# EAGLE design M707C+ (EAGLE 6.6.0)
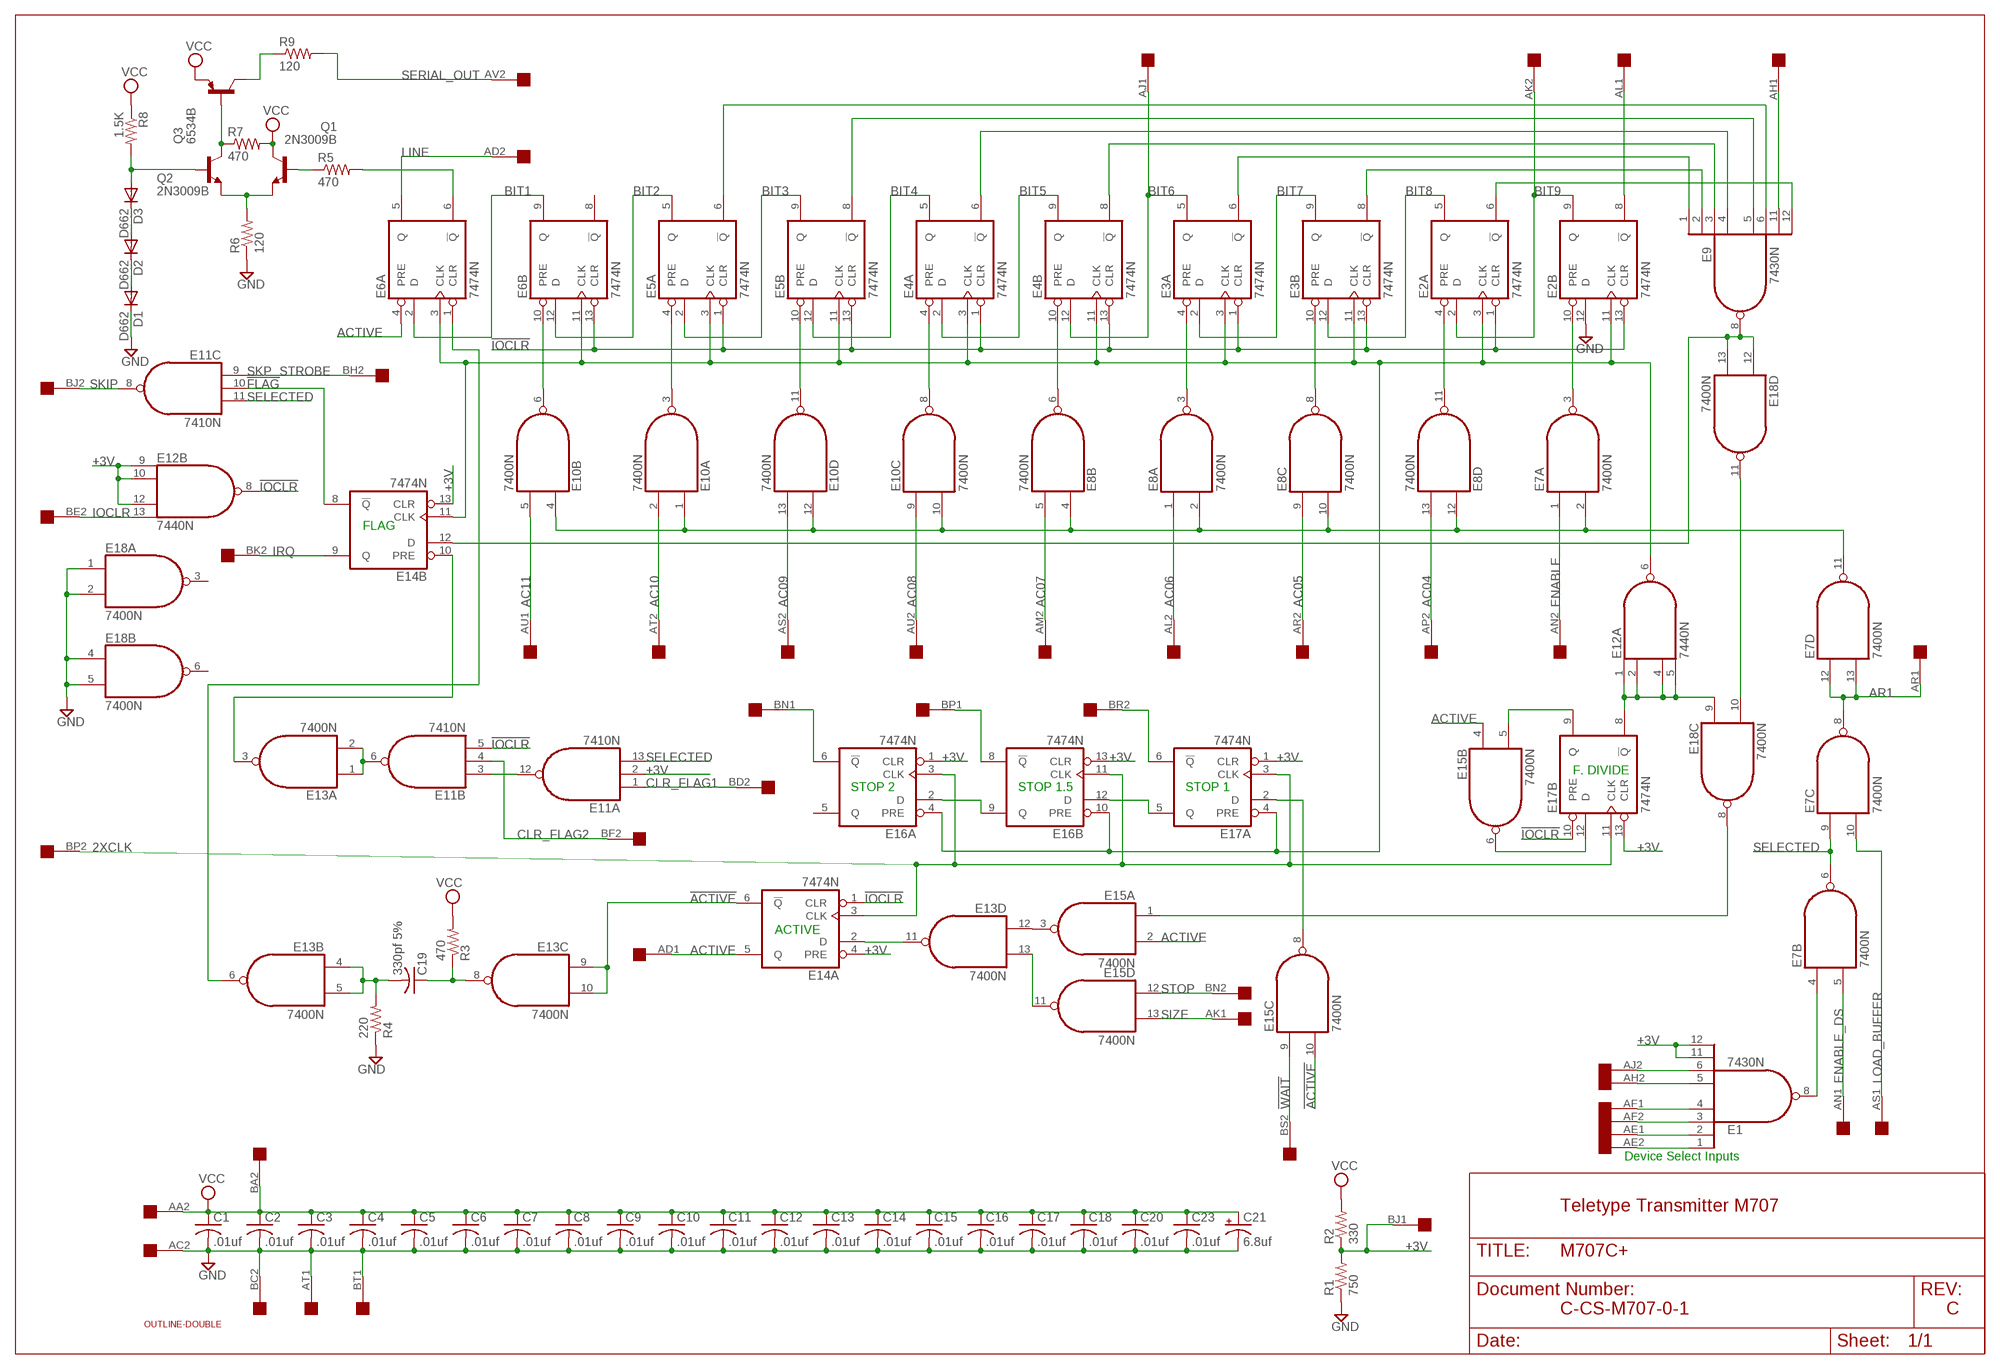
[diagram p0: schematic, sheet 1]

## Parts
C1  .01uf  C-US075-032X103  [C075-032X103]
C2  .01uf  C-US075-032X103  [C075-032X103]
C3  .01uf  C-US075-032X103  [C075-032X103]
C4  .01uf  C-US075-032X103  [C075-032X103]
C5  .01uf  C-US075-032X103  [C075-032X103]
C6  .01uf  C-US075-032X103  [C075-032X103]
C7  .01uf  C-US075-032X103  [C075-032X103]
C8  .01uf  C-US075-032X103  [C075-032X103]
C9  .01uf  C-US075-032X103  [C075-032X103]
C10  .01uf  C-US075-032X103  [C075-032X103]
C11  .01uf  C-US075-032X103  [C075-032X103]
C12  .01uf  C-US075-032X103  [C075-032X103]
C13  .01uf  C-US075-032X103  [C075-032X103]
C14  .01uf  C-US075-032X103  [C075-032X103]
C15  .01uf  C-US075-032X103  [C075-032X103]
C16  .01uf  C-US075-032X103  [C075-032X103]
C17  .01uf  C-US075-032X103  [C075-032X103]
C18  .01uf  C-US075-032X103  [C075-032X103]
C19  330pf 5%  C-US150-054X183  [C150-054X183]
C20  .01uf  C-US075-032X103  [C075-032X103]
C21  6.8uf  CPOL-USE15-5AXIAL  [E15-5]
C23  .01uf  C-US075-032X103  [C075-032X103]
D1  D662  BY609  [SOD61B]
D2  D662  BY609  [SOD61B]
D3  D662  BY609  [SOD61B]
E1  7430N  [DIL14]
E2  7474N  74S74N  [DIL14]
E3  7474N  74S74N  [DIL14]
E4  7474N  74S74N  [DIL14]
E5  7474N  74S74N  [DIL14]
E6  7474N  74S74N  [DIL14]
E7  7400N  [DIL14]
E8  7400N  [DIL14]
E9  7430N  [DIL14]
E10  7400N  [DIL14]
E11  7410N  [DIL14]
E12  7440N  74S20N  [DIL14]
E13  7400N  [DIL14]
E14  7474N  74S74N  [DIL14]
E15  7400N  [DIL14]
E16  7474N  74S74N  [DIL14]
E17  7474N  74S74N  [DIL14]
E18  7400N  [DIL14]
Q1  2N3009B  2N4124-NPN-TO92-CBE  [TO92-CBE]
Q2  2N3009B  2N4124-NPN-TO92-CBE  [TO92-CBE]
Q3  6534B  2N4126-PNP-TO92-CBE  [TO92-CBE]
R1  750  R-US_0207/15  [0207/15]
R2  330  R-US_0207/15  [0207/15]
R3  470  R-US_0207/10  [0207/10]
R4  220  R-US_0207/10  [0207/10]
R5  470  R-US_0207/10  [0207/10]
R6  120  R-US_0207/15  [0207/15]
R7  470  R-US_0207/10  [0207/10]
R8  1.5K  R-US_0207/15  [0207/15]
R9  120  R-US_0204/7  [0204/7]
U$1  OUTLINE-DOUBLE  [DOUBLE]
U$2  DOUBLE  [EDGE-CON4]

## Nets
2XCLK: E14.3(A:CLK) E16.3(A:CLK) E16.11(B:CLK) E17.3(A:CLK) E17.11(B:CLK) U$2.BP2
!ACTIVE: E13.9(C:I0) E13.10(C:I1) E14.6(A:!Q) E15.10(C:I1)
!FLAG: E11.10(C:I1) E14.8(B:!Q)
!IOCLR: E2.1(A:CLR) E2.13(B:CLR) E3.1(A:CLR) E3.13(B:CLR) E4.1(A:CLR) E4.13(B:CLR) E5.1(A:CLR) E5.13(B:CLR) E6.13(B:CLR) E11.5(B:I2) E12.8(B:O) E14.1(A:CLR) E17.10(B:PRE)
!WAIT: E15.9(C:I0) U$2.BS2
+3V: E1.11(I6) E1.12(I7) E11.2(A:I1) E12.9(B:I0) E12.10(B:I1) E12.12(B:I2) E14.4(A:PRE) E14.13(B:CLR) E16.1(A:CLR) E16.13(B:CLR) E17.1(A:CLR) E17.13(B:CLR) R1.2 R2.1 U$2.BJ1
AC04: E8.13(D:I1) U$2.AP2
AC05: E8.9(C:I0) U$2.AR2
AC06: E8.1(A:I0) U$2.AL2
AC07: E8.5(B:I1) U$2.AM2
AC08: E10.9(C:I0) U$2.AU2
AC09: E10.13(D:I1) U$2.AS2
AC10: E10.2(A:I1) U$2.AT2
AC11: E10.5(B:I1) U$2.AU1
ACTIVE: E6.4(A:PRE) E14.5(A:Q) E15.2(A:I1) E15.4(B:I0) U$2.AD1
AE1: E1.2(I1) U$2.AE1
AF1: E1.4(I3) U$2.AF1
AH1: E9.11(I6) U$2.AH1
AL1: E2.8(B:!Q) U$2.AL1
AR1: E7.8(C:O) E7.12(D:I0) E7.13(D:I1) U$2.AR1
BIT1: E6.2(A:D) E6.9(B:Q)
BIT2: E5.5(A:Q) E6.12(B:D)
BIT3: E5.2(A:D) E5.9(B:Q)
BIT4: E4.5(A:Q) E5.12(B:D)
BIT5: E4.2(A:D) E4.9(B:Q)
BIT6: E3.5(A:Q) E4.12(B:D) U$2.AJ1
BIT7: E3.2(A:D) E3.9(B:Q)
BIT8: E2.5(A:Q) E3.12(B:D)
BIT9: E2.2(A:D) E2.9(B:Q) U$2.AK2
BN1: E16.6(A:!Q) U$2.BN1
BP1: E16.8(B:!Q) U$2.BP1
CLR_FLAG1: E11.1(A:I0) U$2.BD2
CLR_FLAG2: E11.4(B:I1) U$2.BF2
ENABLE: E7.1(A:I0) U$2.AN2
ENABLE_DS: E7.5(B:I1) U$2.AN1
GND [Supply]: C1.2 C2.2 C3.2 C4.2 C5.2 C6.2 C7.2 C8.2 C9.2 C10.2 C11.2 C12.2 C13.2 C14.2 C15.2 C16.2 C17.2 C18.2 C20.2 C21.- C23.2 D1.C E2.12(B:D) E18.1(A:I0) E18.2(A:I1) E18.4(B:I0) E18.5(B:I1) R1.1 R4.1 R6.1 U$2.AC2 U$2.AT1 U$2.BC2 U$2.BT1
IOCLR: E12.13(B:I3) U$2.BE2
IRQ: E14.9(B:Q) U$2.BK2
LINE: E6.5(A:Q) U$2.AD2
LOAD_BUFFER: E7.10(C:I1) U$2.AS1
N$1: C19.1 E13.8(C:O) R3.1
N$2: C19.2 E13.4(B:I0) E13.5(B:I1) R4.2
N$3: E2.4(A:PRE) E8.11(D:O)
N$4: E6.1(A:CLR) E13.6(B:O)
N$5: E2.3(A:CLK) E2.11(B:CLK) E3.3(A:CLK) E3.11(B:CLK) E4.3(A:CLK) E4.11(B:CLK) E5.3(A:CLK) E5.11(B:CLK) E6.3(A:CLK) E6.11(B:CLK) E12.6(A:O) E14.11(B:CLK) E16.4(A:PRE) E16.10(B:PRE) E17.4(A:PRE)
N$6: E9.8(O) E14.12(B:D) E18.12(D:I0) E18.13(D:I1)
N$7: E2.6(A:!Q) E9.12(I7)
N$8: Q3.C R9.1
N$9: E1.8(O) E7.4(B:I0)
N$12: E1.6(I5) U$2.AJ2
N$13: E1.5(I4) U$2.AH2
N$15: E1.3(I2) U$2.AF2
N$17: E1.1(I0) U$2.AE2
N$19: E7.2(A:I1) E7.11(D:O) E8.2(A:I1) E8.4(B:I0) E8.10(C:I1) E8.12(D:I0) E10.1(A:I0) E10.4(B:I0) E10.10(C:I1) E10.12(D:I0)
N$20: E2.10(B:PRE) E7.3(A:O)
N$22: D1.A D2.C
N$23: D2.A D3.C
N$24: Q1.B R5.1
N$26: Q2.C Q3.B R7.1
N$27: Q1.E Q2.E R6.2
N$30: D3.A Q2.B R8.2
N$40: E6.6(A:!Q) R5.2
N$62: E13.13(D:I1) E15.11(D:O)
N$63: E17.6(A:!Q) U$2.BR2
N$65: E3.4(A:PRE) E8.3(A:O)
N$129: E15.1(A:I0) E18.8(C:O)
N$131: E13.12(D:I0) E15.3(A:O)
N$132: E11.3(B:I0) E11.12(A:O)
N$133: E12.1(A:I0) E12.2(A:I1) E12.4(A:I2) E12.5(A:I3) E17.8(B:!Q) E18.9(C:I0)
N$138: E16.2(A:D) E16.9(B:Q)
N$142: E3.6(A:!Q) E9.1(I0)
N$147: E4.4(A:PRE) E10.8(C:O)
N$152: E3.8(B:!Q) E9.2(I1)
N$153: E4.8(B:!Q) E9.3(I2)
N$154: E4.6(A:!Q) E9.4(I3)
N$155: E5.8(B:!Q) E9.5(I4)
N$156: E5.6(A:!Q) E9.6(I5)
N$161: E15.8(C:O) E17.2(A:D)
N$163: E11.6(B:O) E13.1(A:I0) E13.2(A:I1)
N$166: E16.12(B:D) E17.5(A:Q)
N$167: E13.3(A:O) E14.10(B:PRE)
N$171: E5.4(A:PRE) E10.3(A:O)
N$178: E13.11(D:O) E14.2(A:D)
N$358: E15.6(B:O) E17.12(B:D)
N$362: E15.5(B:I1) E17.9(B:Q)
N$378: E3.10(B:PRE) E8.8(C:O)
N$381: E4.10(B:PRE) E8.6(B:O)
N$387: E5.10(B:PRE) E10.11(D:O)
N$393: E6.10(B:PRE) E10.6(B:O)
N$460: E18.10(C:I1) E18.11(D:O)
SELECTED: E7.6(B:O) E7.9(C:I0) E11.11(C:I2) E11.13(A:I2)
SERIAL_OUT: R9.2 U$2.AV2
SIZE: E15.13(D:I1) U$2.AK1
SKIP: E11.8(C:O) U$2.BJ2
SKP_STROBE: E11.9(C:I0) U$2.BH2
STOP: E15.12(D:I0) U$2.BN2
VCC [Supply]: C1.1 C2.1 C3.1 C4.1 C5.1 C6.1 C7.1 C8.1 C9.1 C10.1 C11.1 C12.1 C13.1 C14.1 C15.1 C16.1 C17.1 C18.1 C20.1 C21.+ C23.1 Q1.C Q3.E R2.2 R3.2 R7.2 R8.1 U$2.AA2 U$2.BA2
Unconnected: E6.8(B:!Q) E16.5(A:Q) E18.3(A:O) E18.6(B:O) U$2.AA1 U$2.AB1 U$2.AB2 U$2.AC1 U$2.AM1 U$2.AP1 U$2.AV1 U$2.BA1 U$2.BB1 U$2.BB2 U$2.BC1 U$2.BD1 U$2.BE1 U$2.BF1 U$2.BH1 U$2.BK1 U$2.BL1 U$2.BL2 U$2.BM1 U$2.BM2 U$2.BR1 U$2.BS1 U$2.BT2 U$2.BU1 U$2.BU2 U$2.BV1 U$2.BV2

## Notes on the sheet
- FLAG
- F. DIVIDE
- STOP 2 | STOP 1.5 | STOP 1
- ACTIVE
- Device Select Inputs
- Teletype Transmitter M707
- C-CS-M707-0-1 | C

## Power pins joined to a net without a drawn wire
GND: E1.7(GND) E2.7(P:GND) E3.7(P:GND) E4.7(P:GND) E5.7(P:GND) E6.7(P:GND) E7.7(P:GND) E8.7(P:GND) E9.7(GND) E10.7(P:GND) E11.7(P:GND) E12.7(P:GND) E13.7(P:GND) E14.7(P:GND) E15.7(P:GND) E16.7(P:GND) E17.7(P:GND) E18.7(P:GND)
VCC: E1.14(VCC) E2.14(P:VCC) E3.14(P:VCC) E4.14(P:VCC) E5.14(P:VCC) E6.14(P:VCC) E7.14(P:VCC) E8.14(P:VCC) E9.14(VCC) E10.14(P:VCC) E11.14(P:VCC) E12.14(P:VCC) E13.14(P:VCC) E14.14(P:VCC) E15.14(P:VCC) E16.14(P:VCC) E17.14(P:VCC) E18.14(P:VCC)

## Library data of the parts
C1-C20 C23 = rcl:C-US: CAPACITOR, American symbol
C21 = rcl:CPOL-US: POLARIZED CAPACITOR, American symbol
D1-D3 = diode:BY609: DIODE
E1 E9 = 74xx-us:74*30: 8-input NAND gate
E2-E6 E14 E16 E17 = 74xx-us:74*74: Dual D type positive edge triggered FLIP FLOP, preset and clear
E7 E8 E10 E13 E15 E18 = 74xx-us:74*00: Quad 2-input NAND gate
E11 = 74xx-us:74*10: Triple 3-input NAND gate
E12 = 74xx-us:74*20: Dual 4-input NAND gate
Q1 Q2 = transistor:*-NPN-: NPN Transistror BF959 corrected 2008.03.06
Q3 = transistor:*-PNP-: PNP Transistror
R1-R9 = rcl:R-US_: RESISTOR, American symbol
U$1 = dec-con:OUTLINE-*: Board outlines for DEC boards.
U$2 = dec-con:DOUBLE: Double-Height DEC board

## Net classes
1 Supply: width 0.813 mm

## Board
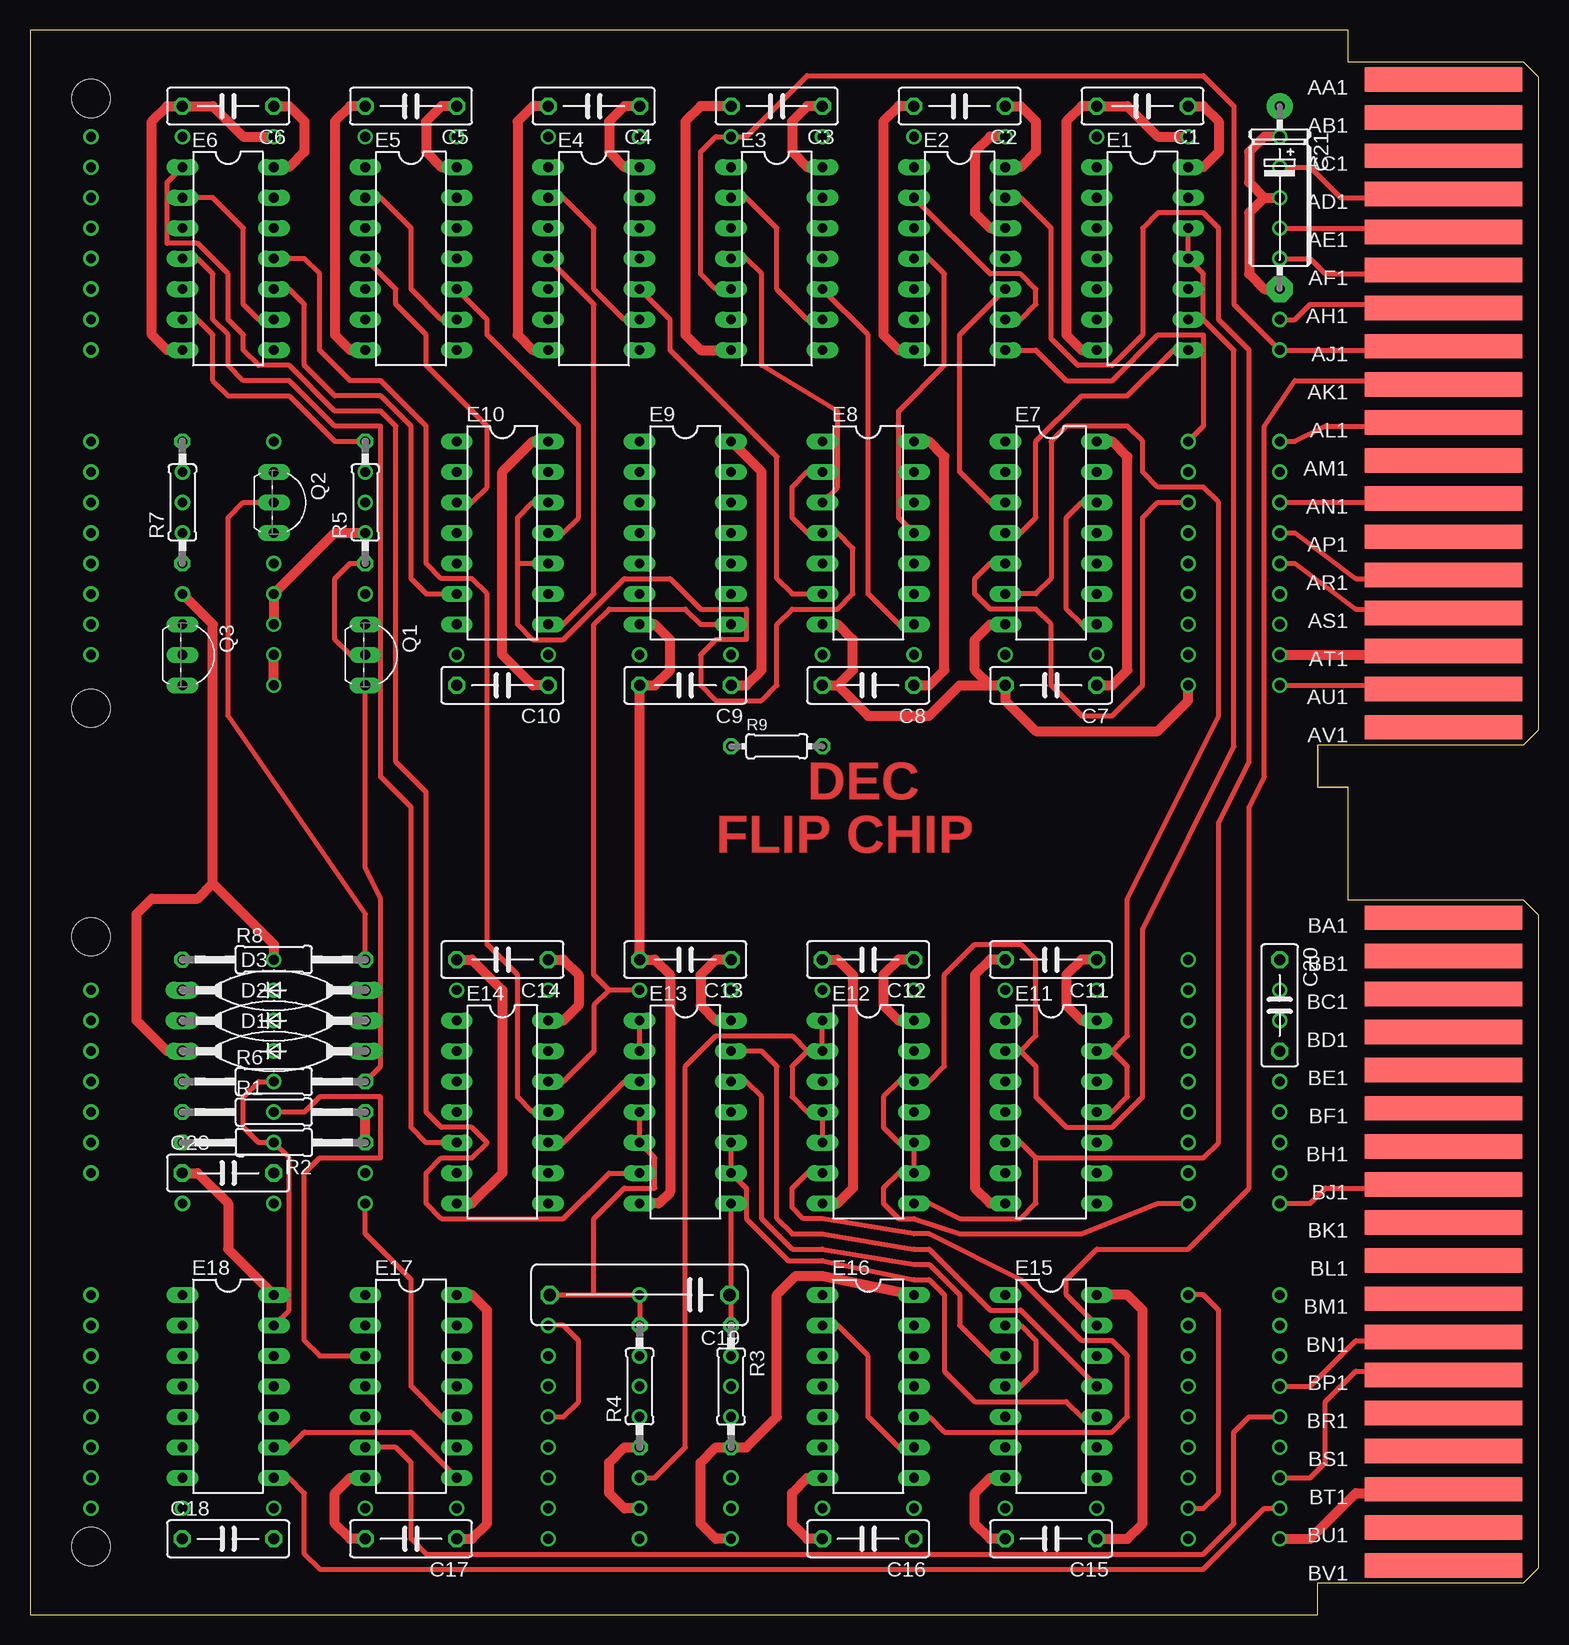
[diagram p1: board, top side]
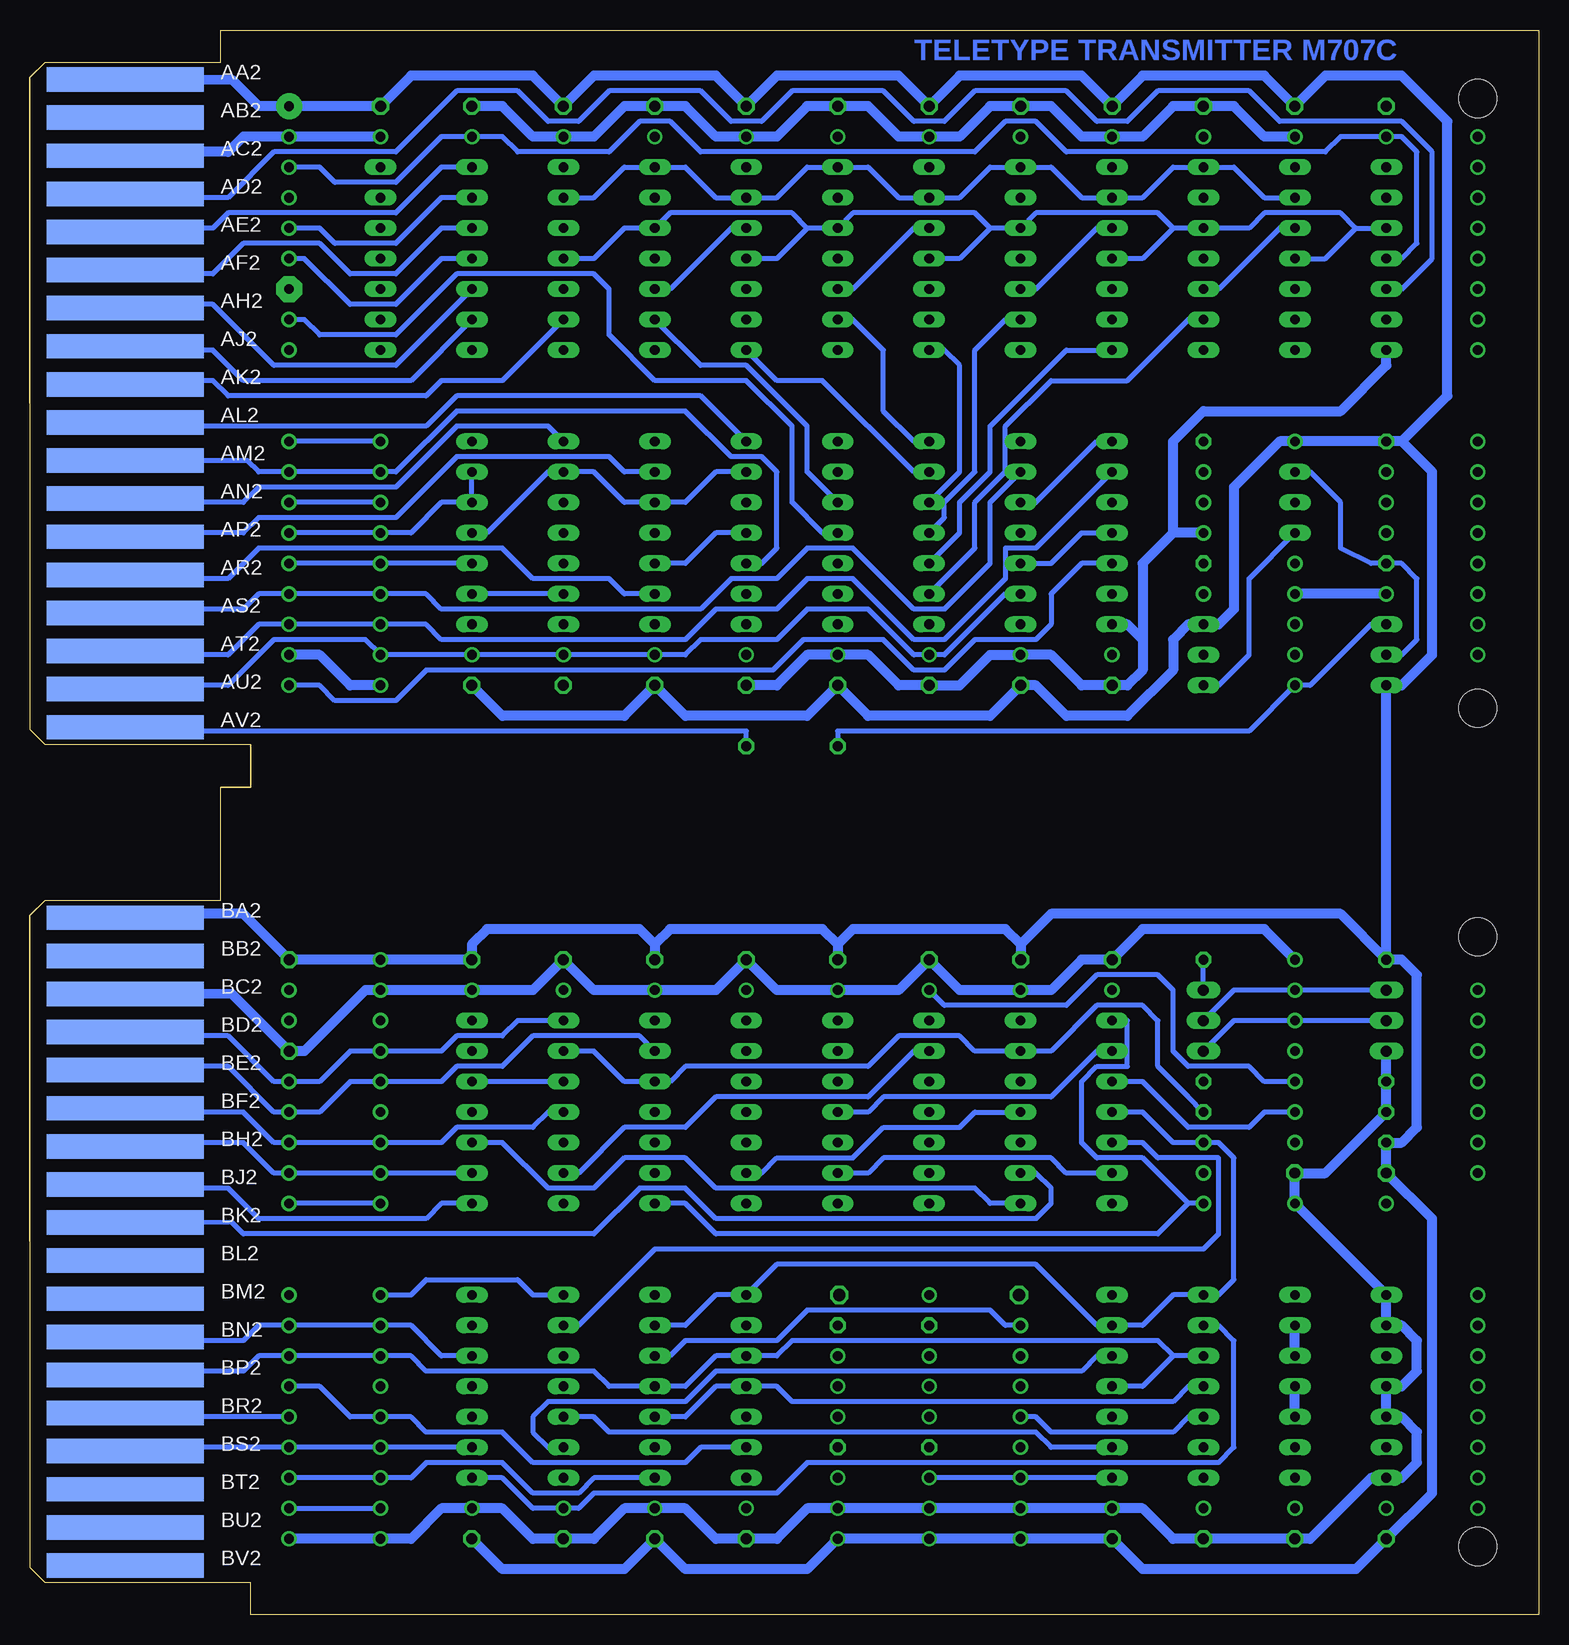
[diagram p2: board, bottom side, seen from below]

Size 125.73 x 132.08 mm. Coordinates in mm from the lower left corner, seen from the top.
Copper layers (1+16): Top 0.035mm / dielectric 1.5mm / Bottom 0.035mm
Design rules "16mils": minimum track width 16mil, minimum drill 32mil, track to track 15mil, track to pad 10mil, pad to pad 10mil, via to via 10mil, smd to smd 10mil, copper to edge 13mil, drill to drill 10mil, minimum pad ring 10mil, minimum via ring 8mil, stop-mask expansion 0mil, vias tented up to drill 0mil, thermal gap 10mil

### Footprints (pad centres in the part's own frame; a part is rotated, then mirrored left to right if it is on the bottom)
C075-032X103 = drill 0.914 octagon: 1 -3.81,0; 2 3.81,0
C150-054X183 = drill 1.016 octagon: 1 -7.493,0; 2 7.493,0
E15-5 = drill 0.813 pad 2.159: + -7.62,0 | drill 0.813 pad 2.159 octagon: - 7.62,0
SOD61B = drill 0.914 long: A 7.62,0; C -7.62,0
DIL14 = drill 0.813 long: 1 -7.62,-3.81; 2 -5.08,-3.81; 3 -2.54,-3.81; 4 0,-3.81; 5 2.54,-3.81; 6 5.08,-3.81; 7 7.62,-3.81; 8 7.62,3.81; 9 5.08,3.81; 10 2.54,3.81; 11 0,3.81; 12 -2.54,3.81; 13 -5.08,3.81; 14 -7.62,3.81
TO92-CBE = drill 0.813 long: B 0,0; C -2.54,0; E 2.54,0
0207/15 = drill 0.813 octagon: 1 -7.62,0; 2 7.62,0
0207/10 = drill 0.813 octagon: 1 -5.08,0; 2 5.08,0
0204/7 = drill 0.813 octagon: 1 -3.81,0; 2 3.81,0
DOUBLE = hole 3.175: 120.65,56.515; 120.65,5.715; 120.65,75.565; 120.65,126.365
EDGE-CON4 = smd 13.106 x 2.032: AA1 7.938,4.128; AB1 7.938,7.303; AC1 7.938,10.477; AD1 7.938,13.652; AE1 7.938,16.828; AF1 7.938,20.003; AH1 7.938,23.177; AJ1 7.938,26.352; AK1 7.938,29.527; AL1 7.938,32.703; AM1 7.938,35.877; AN1 7.938,39.053; AP1 7.938,42.227; AR1 7.938,45.403; AS1 7.938,48.578; AT1 7.938,51.752; AU1 7.938,54.928; AV1 7.938,58.102; BA1 7.938,73.978; BB1 7.938,77.153; BC1 7.938,80.328; BD1 7.938,83.502; BE1 7.938,86.677; BF1 7.938,89.853; BH1 7.938,93.028; BJ1 7.938,96.203; BK1 7.938,99.377; BL1 7.938,102.552; BM1 7.938,105.728; BN1 7.938,108.903; BP1 7.938,112.078; BR1 7.938,115.252; BS1 7.938,118.427; BT1 7.938,121.603; BU1 7.938,124.778; BV1 7.938,127.953 | smd 13.106 x 2.032 bottom: AA2 7.938,4.128; AB2 7.938,7.303; AC2 7.938,10.477; AD2 7.938,13.652; AE2 7.938,16.828; AF2 7.938,20.003; AH2 7.938,23.177; AJ2 7.938,26.352; AK2 7.938,29.527; AL2 7.938,32.703; AM2 7.938,35.877; AN2 7.938,39.053; AP2 7.938,42.227; AR2 7.938,45.403; AS2 7.938,48.578; AT2 7.938,51.752; AU2 7.938,54.928; AV2 7.938,58.102; BA2 7.938,73.978; BB2 7.938,77.153; BC2 7.938,80.328; BD2 7.938,83.502; BE2 7.938,86.677; BF2 7.938,89.853; BH2 7.938,93.028; BJ2 7.938,96.203; BK2 7.938,99.377; BL2 7.938,102.552; BM2 7.938,105.728; BN2 7.938,108.903; BP2 7.938,112.078; BR2 7.938,115.252; BS2 7.938,118.427; BT2 7.938,121.603; BU2 7.938,124.778; BV2 7.938,127.953

### Placement (x,y rotation side)
C1  92.71,125.73 180 top
C2  77.47,125.73 180 top
C3  62.23,125.73 180 top
C4  46.99,125.73 180 top
C5  31.75,125.73 180 top
C6  16.51,125.73 180 top
C7  85.09,77.47 180 top
C8  69.85,77.47 180 top
C9  54.61,77.47 180 top
C10  39.37,77.47 180 top
C11  85.09,54.61 180 top
C12  69.85,54.61 180 top
C13  54.61,54.61 180 top
C14  39.37,54.61 180 top
C15  85.09,6.35 180 top
C16  69.85,6.35 180 top
C17  31.75,6.35 180 top
C18  16.51,6.35 0 top
C19  50.8,26.67 180 top
C20  104.14,50.8 270 top
C21  104.14,118.11 270 top
C23  16.51,36.83 0 top
D1  20.32,46.99 0 top
D2  20.32,49.53 0 top
D3  20.32,52.07 0 top
E1  92.71,113.03 270 top
E2  77.47,113.03 270 top
E3  62.23,113.03 270 top
E4  46.99,113.03 270 top
E5  31.75,113.03 270 top
E6  16.51,113.03 270 top
E7  85.09,90.17 270 top
E8  69.85,90.17 270 top
E9  54.61,90.17 270 top
E10  39.37,90.17 270 top
E11  85.09,41.91 270 top
E12  69.85,41.91 270 top
E13  54.61,41.91 270 top
E14  39.37,41.91 270 top
E15  85.09,19.05 270 top
E16  69.85,19.05 270 top
E17  31.75,19.05 270 top
E18  16.51,19.05 270 top
Q1  27.94,80.01 270 top
Q2  20.32,92.71 270 top
Q3  12.7,80.01 270 top
R1  20.32,41.91 0 top
R2  20.32,39.37 180 top
R3  58.42,19.05 270 top
R4  50.8,19.05 90 top
R5  27.94,92.71 90 top
R6  20.32,44.45 0 top
R7  12.7,92.71 90 top
R8  20.32,54.61 0 top
R9  62.23,72.39 0 top
U$1  125.73,132.08 180 top
U$2  125.73,132.08 180 top

### Tracks (layer width: path | path; a pad name or v marks a point on that pad's centre or on a via)
2XCLK  (via drill 0.81 pad 1.27)
  Top 0.406: E17.3 24.13,21.59 22.86,22.86 22.86,36.83 24.13,38.1 29.21,38.1 29.21,43.18 24.13,43.18 22.86,41.91 v20.32,41.91
  Bottom 0.406: E17.3 30.48,21.59 | 30.48,21.59 33.02,19.05 E17.11 | 30.48,21.59 31.75,22.86 62.23,22.86 63.5,21.59 E16.3 68.58,21.59 71.12,19.05 E16.11 77.47,19.05 78.74,20.32 92.71,20.32 93.98,21.59 v96.52,21.59 v104.14,21.59 106.68,21.59 107.95,20.32 111.76,20.32 112.09,19.99 U$2.BP2 | v20.32,41.91 22.86,41.91 24.13,40.64 29.21,40.64 33.02,44.45 E14.3
!ACTIVE
  Top 0.406: E15.10 87.63,16.51 86.36,17.78 78.74,17.78 76.2,20.32 76.2,26.67 74.93,27.94 73.66,27.94 66.04,29.53 63.18,29.53 59.69,33.02 59.69,35.56 E13.9 E13.10
  Bottom 0.406: E14.6 39.37,36.83 40.64,38.1 54.61,38.1 55.88,36.83 E13.9
!FLAG
  Bottom 0.406: E11.10 86.36,39.37 82.55,35.56 78.74,35.56 76.2,38.1 71.12,38.1 68.58,35.56 46.99,35.56 45.72,34.29 E14.8
!IOCLR  (via drill 0.81 pad 1.27)
  Top 0.406: E2.13 82.55,118.11 85.09,115.57 85.09,106.36 87.31,104.14 90.17,104.14 92.71,106.68 92.71,115.57 93.98,116.84 97.79,116.84 99.06,115.57 99.06,107.95 101.6,105.41 101.6,71.12 99.06,66.04 99.06,39.37 97.79,38.1 83.82,38.1 | E12.8 74.93,34.29 77.47,33.02 82.55,33.02 83.82,34.29 83.82,38.1 | 83.82,38.1 82.55,39.37 E11.5 | v27.94,34.29 27.94,31.75 31.75,27.94 31.75,19.05 34.29,16.51 E17.10
  Bottom 0.406: E6.13 22.86,118.11 25.4,120.65 E5.1 30.48,120.65 33.02,118.11 E5.13 38.1,118.11 40.64,120.65 E4.1 45.72,120.65 48.26,118.11 E4.13 53.34,118.11 55.88,120.65 E3.1 60.96,120.65 63.5,118.11 E3.13 68.58,118.11 71.12,120.65 E2.1 76.2,120.65 78.74,118.11 E2.13 | v27.94,34.29 29.21,34.29 | 29.21,34.29 33.02,38.1 36.83,38.1 38.1,39.37 38.1,44.45 36.83,45.72 34.29,45.72 34.29,49.53 E14.1 | 29.21,34.29 31.75,31.75 68.58,31.75 71.12,34.29 E12.8
!WAIT  (via drill 0.81 pad 1.27)
  Bottom 0.406: E15.9 v96.52,13.97 v104.14,13.97 111.76,13.97 112.06,13.66 U$2.BS2
+3V  (via drill 0.81 pad 1.27)
  Top 0.406: v104.14,34.29 106.68,34.29 107.95,35.56 114.3,35.56 114.63,35.89 U$2.BJ1 | E1.12 E1.11 97.79,111.76 97.79,107.95 100.33,105.41 100.33,72.39 92.71,57.15 92.71,43.18 90.17,40.64 86.36,40.64 83.82,43.18 83.82,45.72 82.55,46.99 | v96.52,34.29 93.98,34.29 87.63,31.75 77.47,31.75 73.66,33.02 72.39,33.02 71.12,34.29 71.12,35.56 72.39,36.83 E12.9 E12.10 72.39,39.37 71.12,40.64 71.12,43.18 72.39,44.45 E12.12 74.93,44.45 76.2,45.72 76.2,53.34 78.74,55.88 82.55,55.88 83.82,54.61 83.82,48.26 82.55,46.99 | E11.2 82.55,46.99
  Top 0.813: R2.1 R1.2
  Bottom 0.406: v96.52,34.29 v104.14,34.29 | E16.13 71.12,24.13 68.58,26.67 E16.1 63.5,29.21 41.91,29.21 36.83,24.13 E17.13 33.02,24.13 30.48,26.67 E17.1 26.67,26.67 25.4,27.94 25.4,38.1 26.67,39.37 R2.1 30.48,39.37 33.02,41.91 E14.4 | E11.2 78.74,46.99 76.2,44.45 E12.12 72.39,44.45 71.12,45.72 55.88,45.72 53.34,48.26 48.26,48.26 46.99,46.99 E14.13 40.64,46.99 36.83,50.8 33.02,50.8 31.75,49.53 31.75,45.72 29.21,43.18 R1.2
AC04
  Bottom 0.406: U$2.AP2 112.09,89.84 111.76,90.17 107.95,90.17 106.68,91.44 95.25,91.44 90.17,96.52 77.47,96.52 76.2,95.25 E8.13
AC05
  Bottom 0.406: E8.9 76.2,85.09 77.47,86.36 83.82,86.36 86.36,88.9 106.68,88.9 109.22,86.36 111.76,86.36 112.09,86.69 U$2.AR2
AC06
  Bottom 0.406: U$2.AL2 112.09,99.39 111.76,99.06 92.71,99.06 90.17,101.6 69.85,101.6 E8.1
AC07  (via drill 0.81 pad 1.27)
  Bottom 0.406: U$2.AM2 107.62,96.19 106.68,95.25 v104.14,95.25 v96.52,95.25 95.25,95.25 90.17,100.33 71.12,100.33 67.31,96.52 64.77,96.52 63.5,95.25 63.5,88.9 64.77,87.63 E8.5
AC08  (via drill 0.81 pad 1.27)
  Bottom 0.406: U$2.AU2 112.12,77.11 111.76,77.47 109.22,77.47 105.41,81.28 97.79,81.28 v96.52,80.01 v88.9,80.01 v81.28,80.01 v73.66,80.01 71.12,80.01 69.85,81.28 63.5,81.28 60.96,83.82 55.88,83.82 52.07,80.01 v50.8,80.01 49.53,80.01 44.45,85.09 E10.9
AC09  (via drill 0.81 pad 1.27)
  Bottom 0.406: U$2.AS2 112.06,83.52 111.76,83.82 107.95,83.82 106.68,85.09 v104.14,85.09 v96.52,85.09 92.71,85.09 91.44,83.82 69.85,83.82 67.31,86.36 63.5,86.36 60.96,88.9 57.15,88.9 52.07,83.82 49.53,83.82 45.72,87.63 45.72,92.71 E10.13
AC10  (via drill 0.81 pad 1.27)
  Bottom 0.406: U$2.AT2 112.09,80.34 111.76,80.01 109.22,80.01 106.68,82.55 v104.14,82.55 v96.52,82.55 92.71,82.55 91.44,81.28 71.12,81.28 68.58,83.82 63.5,83.82 60.96,86.36 57.15,86.36 52.07,81.28 49.53,81.28 44.45,86.36 44.45,88.9 41.91,88.9 E10.2
AC11  (via drill 0.81 pad 1.27)
  Top 0.406: v104.14,77.47 114.3,77.47 114.63,77.14 U$2.AU1
  Bottom 0.406: E10.5 38.1,87.63 40.64,85.09 40.64,82.55 41.91,81.28 46.99,81.28 49.53,78.74 52.07,78.74 54.61,81.28 61.28,81.28 63.82,78.74 92.71,78.74 95.25,76.2 100.33,76.2 101.6,77.47 v104.14,77.47
ACTIVE  (via drill 0.81 pad 1.27)
  Top 0.406: v104.14,120.65 106.68,120.65 109.22,118.11 118.11,118.11 118.05,118.17 U$2.AD1 | E14.5 33.02,39.37 31.75,40.64 31.75,67.31 29.21,69.85 29.21,99.06 25.4,99.06 21.59,102.87 17.78,102.87 16.51,104.14 16.51,106.68 15.24,107.95 15.24,111.76 13.97,113.03 E6.4 | E15.4 82.55,19.05 83.82,20.32 83.82,22.86 82.55,24.13 E15.2
  Bottom 0.406: v104.14,120.65 101.6,120.65 100.33,119.38 95.25,119.38 91.44,123.19 v88.9,123.19 86.36,123.19 85.09,121.92 77.47,121.92 74.93,124.46 72.39,124.46 69.85,121.92 46.99,121.92 44.45,124.46 41.91,124.46 39.37,121.92 17.78,121.92 16.51,123.19 v12.7,123.19 11.43,123.19 10.16,121.92 10.16,114.3 11.43,113.03 E6.4 | E15.2 80.01,24.13 73.66,30.48 27.94,30.48 26.67,31.75 26.67,35.56 26.67,38.1 31.75,38.1 33.02,39.37 E14.5
AE1  (via drill 0.81 pad 1.27)
  Top 0.406: v104.14,115.57 116.84,115.57 117.17,115.24 U$2.AE1
  Bottom 0.406: v104.14,115.57 101.6,115.57 100.33,114.3 95.25,114.3 91.44,118.11 E1.2
AF1  (via drill 0.81 pad 1.27)
  Top 0.406: v104.14,113.03 106.68,113.03 107.95,111.76 118.11,111.76 118.06,111.81 U$2.AF1
  Bottom 0.406: E1.4 91.44,113.03 95.25,109.22 99.06,109.22 102.87,113.03 v104.14,113.03
AH1  (via drill 0.81 pad 1.27)
  Top 0.406: v104.14,107.95 105.41,107.95 106.68,109.22 116.84,109.22 117.17,108.89 U$2.AH1
  Bottom 0.406: v104.14,107.95 102.87,107.95 101.6,106.68 95.25,106.68 90.17,111.76 78.74,111.76 77.47,110.49 77.47,106.68 73.66,102.87 66.04,102.87 62.23,99.06 62.23,92.71 59.69,90.17 E9.11
AL1  (via drill 0.81 pad 1.27)
  Top 0.406: E2.8 83.82,105.41 86.36,102.87 90.17,102.87 93.98,106.68 97.79,106.68 97.79,99.06 v96.52,97.79 | v104.14,97.79 105.41,97.79 107.95,99.06 114.3,99.06 114.63,99.39 U$2.AL1
  Bottom 0.406: v96.52,97.79 v104.14,97.79
AR1  (via drill 0.81 pad 1.27)
  Top 0.406: v104.14,90.17 105.41,90.17 110.49,86.36 116.84,86.36 117.17,86.69 U$2.AR1 | E7.8 87.63,82.55 86.36,83.82 86.36,91.44 87.63,92.71 E7.12
  Bottom 0.406: v104.14,90.17 v96.52,90.17 93.98,90.17 91.44,92.71 E7.12 E7.13
BIT1
  Top 0.406: E6.2 15.24,118.11 17.78,115.57 17.78,109.22 19.05,107.95 E6.9
BIT2
  Bottom 0.406: E6.12 21.59,115.57 26.67,110.49 E5.5
BIT3
  Top 0.406: E5.2 29.21,118.11 31.75,115.57 31.75,110.49 34.29,107.95 E5.9
BIT4
  Bottom 0.406: E5.12 36.83,115.57 41.91,110.49 E4.5
BIT5
  Top 0.406: E4.2 44.45,118.11 46.99,115.57 46.99,110.49 49.53,107.95 E4.9
BIT6  (via drill 0.81 pad 1.27)
  Top 0.406: U$2.AJ1 114.63,105.74 114.3,105.41 v104.14,105.41 100.33,109.22 100.33,125.73 97.79,128.27 64.77,128.27 59.69,123.19 v58.42,123.19 57.15,123.19 55.88,121.92 55.88,111.76 57.15,110.49 E3.5
  Bottom 0.406: E4.12 52.07,115.57 57.15,110.49 E3.5
BIT7
  Top 0.406: E3.2 59.69,118.11 62.23,115.57 62.23,110.49 64.77,107.95 E3.9
BIT8
  Bottom 0.406: E3.12 67.31,115.57 72.39,110.49 E2.5
BIT9
  Top 0.406: E2.9 82.55,107.95 83.82,109.22 83.82,110.49 82.55,111.76 80.01,111.76 E2.2
  Bottom 0.406: U$2.AK2 112.06,102.56 111.76,102.87 110.49,102.87 109.22,101.6 92.71,101.6 91.44,102.87 86.36,102.87 E2.9
BN1  (via drill 0.81 pad 1.27)
  Top 0.406: v104.14,19.05 106.68,19.05 110.49,22.86 114.3,22.86 114.63,23.19 U$2.BN1
  Bottom 0.406: v104.14,19.05 101.6,19.05 99.06,16.51 v96.52,16.51 93.98,16.51 92.71,15.24 86.36,15.24 83.82,12.7 71.12,12.7 69.85,13.97 E16.6
BP1  (via drill 0.81 pad 1.27)
  Top 0.406: v104.14,11.43 106.68,11.43 107.95,12.7 107.95,17.78 110.49,20.32 116.84,20.32 117.17,19.99 U$2.BP1
  Bottom 0.406: v104.14,11.43 v96.52,11.43 93.98,11.43 92.71,12.7 86.36,12.7 83.82,10.16 80.01,10.16 78.74,11.43 E16.8
CLR_FLAG1  (via drill 0.81 pad 1.27)
  Bottom 0.406: U$2.BD2 112.06,48.56 111.76,48.26 109.22,48.26 105.41,44.45 v104.14,44.45 101.6,44.45 99.06,46.99 v96.52,46.99 91.44,46.99 90.17,48.26 86.36,48.26 85.09,49.53 E11.1
CLR_FLAG2  (via drill 0.81 pad 1.27)
  Bottom 0.406: U$2.BF2 112.04,42.19 111.76,41.91 107.95,41.91 105.41,39.37 v104.14,39.37 v96.52,39.37 91.44,39.37 90.17,40.64 83.82,40.64 82.55,41.91 E11.4
ENABLE
  Bottom 0.406: U$2.AN2 112.09,93.04 111.76,92.71 107.95,92.71 106.68,93.98 95.25,93.98 90.17,99.06 82.55,99.06 E7.1
ENABLE_DS  (via drill 0.81 pad 1.27)
  Top 0.406: v104.14,92.71 115.57,92.71 115.9,93.04 U$2.AN1 | E7.5 80.01,87.63 78.74,86.36 78.74,85.09 80.01,83.82 82.55,83.82 83.82,83.82 85.09,82.55 85.09,77.47 87.63,74.93 90.17,74.93 92.71,77.47 92.71,91.44 93.98,92.71 v96.52,92.71
  Bottom 0.406: v96.52,92.71 v104.14,92.71
GND  (via drill 0.81 pad 1.27)
  Top 0.813: E1.7 87.63,105.41 86.36,106.68 86.36,124.46 87.63,125.73 C1.2 91.44,125.73 93.98,123.19 v96.52,123.19 | E6.7 11.43,105.41 10.16,106.68 10.16,124.46 11.43,125.73 C6.2 15.24,125.73 17.78,123.19 v20.32,123.19 | E5.7 26.67,105.41 25.4,106.68 25.4,124.46 26.67,125.73 C5.2 | E4.7 41.91,105.41 40.64,106.68 40.64,124.46 41.91,125.73 C4.2 | E3.7 55.88,105.41 54.61,106.68 54.61,124.46 55.88,125.73 C3.2 | E2.7 72.39,105.41 71.12,106.68 71.12,124.46 72.39,125.73 C2.2 | E11.7 80.01,34.29 78.74,35.56 78.74,53.34 80.01,54.61 C11.2 | 80.01,77.47 78.74,78.74 78.74,81.28 80.01,82.55 E7.7 | 67.31,77.47 68.58,78.74 68.58,81.28 67.31,82.55 E8.7 | E9.7 52.07,82.55 53.34,81.28 53.34,78.74 52.07,77.47 C9.2 C13.2 52.07,54.61 53.34,53.34 53.34,35.24 52.39,34.29 E13.7 | E14.7 36.83,34.29 39.37,36.83 39.37,52.07 36.83,54.61 C14.2 | R4.1 49.53,13.97 48.26,12.7 48.26,10.16 49.53,8.89 v50.8,8.89 | E12.7 67.31,34.29 68.58,35.56 68.58,53.34 67.31,54.61 C12.2 | E15.7 80.01,11.43 78.74,10.16 78.74,7.62 80.01,6.35 C15.2 | E16.7 64.77,11.43 63.5,10.16 63.5,7.62 64.77,6.35 C16.2 | 80.01,77.47 77.47,77.47 74.93,74.93 69.85,74.93 67.31,77.47 | D1.C 11.43,46.99 8.89,49.53 8.89,58.42 10.16,59.69 13.97,59.69 15.24,60.96 | 15.24,60.96 15.24,82.55 v12.7,85.09 | 15.24,60.96 20.32,55.88 v20.32,54.61 | v20.32,82.55 v20.32,85.09 25.4,90.17 v27.94,90.17 | v104.14,6.35 106.68,6.35 110.49,10.16 114.3,10.16 114.63,10.49 U$2.BT1 | v96.52,77.47 96.52,76.2 93.98,73.66 83.82,73.66 81.28,76.2 C7.2 80.01,77.47 | v104.14,80.01 115.57,80.01 115.9,80.34 U$2.AT1 | C21.- 102.87,110.49 101.6,111.76 101.6,116.84 102.87,118.11
  Top 0.813: 102.87,118.11 v104.14,118.11 | v104.14,123.19 102.87,123.19 101.6,121.92 101.6,119.38 102.87,118.11 | E2.12 80.01,115.57 78.74,116.84 78.74,121.92 80.01,123.19 v81.28,123.19 | C17.2 26.67,6.35 25.4,7.62 25.4,10.16 26.67,11.43 E17.7 | C8.2 67.31,77.47
  Bottom 0.813: D1.C R6.1 R1.1 17.78,36.83 C23.2 v20.32,34.29 E18.1 E18.2 11.43,24.13 10.16,22.86 10.16,20.32 11.43,19.05 E18.4 E18.5 11.43,16.51 10.16,15.24 10.16,12.7 11.43,11.43 E18.7 13.97,11.43 19.05,6.35 C18.2 C17.2 30.48,6.35 33.02,8.89 v35.56,8.89 v43.18,8.89 v50.8,8.89 v58.42,8.89 60.96,8.89 63.5,6.35 C16.2 68.58,6.35 71.12,8.89 v73.66,8.89 76.2,8.89 78.74,6.35 C15.2 83.82,6.35 86.36,8.89 v88.9,8.89 91.44,8.89 93.98,6.35 v96.52,6.35 v104.14,6.35 | v12.7,85.09 v20.32,85.09 | 33.02,81.28 33.02,78.74 34.29,77.47 C10.2 38.1,77.47 40.64,80.01 v43.18,80.01 45.72,80.01 48.26,77.47 C9.2 53.34,77.47 55.88,80.01 v58.42,80.01 60.96,80.01 63.5,77.47 C8.2 | 33.02,81.28 34.29,82.55 E10.7 | v27.94,90.17 30.48,90.17 | 30.48,90.17 33.02,87.63 33.02,81.28 | v96.52,77.47 99.06,77.47 101.6,80.01 v104.14,80.01 | U$2.AC2 114.63,121.59 114.3,121.92 109.22,121.92 107.95,123.19 v104.14,123.19 v96.52,123.19 | v20.32,123.19 22.86,123.19 25.4,125.73 C5.2 30.48,125.73 33.02,123.19 v35.56,123.19 38.1,123.19 40.64,125.73 C4.2 45.72,125.73 48.26,123.19 v50.8,123.19 53.34,123.19 55.88,125.73 C3.2 60.96,125.73 63.5,123.19 v66.04,123.19 68.58,123.19 71.12,125.73 C2.2 76.2,125.73 78.74,123.19 v81.28,123.19 83.82,123.19 86.36,125.73 C1.2 | U$2.BC2 108.89,51.74 C20.2 102.87,46.99 97.79,52.07 v96.52,52.07 v88.9,52.07 83.82,52.07 C11.2 78.74,52.07 v73.66,52.07 68.58,52.07 C12.2 63.5,52.07 v58.42,52.07 53.34,52.07 C13.2 48.26,52.07 v43.18,52.07 40.64,52.07 38.1,54.61 C14.2 33.02,57.15 22.86,57.15 v20.32,54.61 | 30.48,90.17 30.48,97.79 27.94,100.33 16.51,100.33 12.7,104.14 E6.7
IOCLR  (via drill 0.81 pad 1.27)
  Bottom 0.406: U$2.BE2 112.09,45.39 111.76,45.72 109.22,45.72 105.41,41.91 v104.14,41.91 101.6,41.91 99.06,44.45 v96.52,44.45 91.44,44.45 90.17,45.72 86.36,45.72 83.82,48.26 74.93,48.26 E12.13
IRQ
  Bottom 0.406: E14.9 41.91,36.83 40.64,35.56 40.64,34.29 41.91,33.02 68.58,33.02 71.12,35.56 74.93,35.56 78.74,31.75 107.95,31.75 108.92,32.72 U$2.BK2
LINE
  Bottom 0.406: U$2.AD2 112.06,118.42 111.76,118.11 109.22,118.11 105.41,121.92 95.25,121.92 90.17,127 85.09,127 82.55,124.46 80.01,124.46 77.47,127 69.85,127 67.31,124.46 64.77,124.46 62.23,127 54.61,127 52.07,124.46 49.53,124.46 46.99,127 39.37,127 36.83,124.46 34.29,124.46 31.75,127 24.13,127 21.59,124.46 11.43,124.46 8.89,121.92 8.89,113.03 11.43,110.49 E6.5
LOAD_BUFFER  (via drill 0.81 pad 1.27)
  Top 0.406: v104.14,87.63 105.41,87.63 110.49,83.82 115.57,83.82 115.88,83.52 U$2.AS1
  Bottom 0.406: v104.14,87.63 v96.52,87.63 E7.10
N$1
  Top 0.406: 58.42,26.67 C19.1 | R3.1 58.42,26.67 | 58.42,26.67 E13.8
N$2  (via drill 0.81 pad 1.27)
  Top 0.406: 46.99,26.67 46.99,33.02 49.53,35.56 52.07,35.56 52.07,38.1 E13.5 E13.4 | C19.2 46.99,26.67 | 46.99,26.67 v50.8,26.67 R4.2
N$3
  Top 0.406: E8.11 72.39,91.44 72.39,100.33 76.2,104.14 76.2,111.76 74.93,113.03 E2.4
N$4
  Top 0.406: E13.6 48.26,36.83 44.45,33.02 34.29,33.02 33.02,34.29 33.02,36.83 34.29,38.1 36.83,38.1 38.1,39.37 36.83,40.64 34.29,40.64 33.02,41.91 33.02,68.58 30.48,71.12 30.48,99.06 29.21,100.33 25.4,100.33 21.59,104.14 19.05,104.14 17.78,105.41 17.78,106.68 16.51,107.95 16.51,111.76 13.97,114.3 11.43,114.3 11.43,119.38 E6.1
N$5
  Top 0.406: E16.10 74.93,16.51 76.2,15.24 90.17,15.24 91.44,16.51 91.44,21.59 90.17,22.86 87.63,22.86 82.55,27.94 74.93,31.75 73.66,31.75 66.04,33.02 64.45,33.02 63.5,33.97 63.5,35.56 64.77,36.83 E12.6 | E6.11 22.86,113.03 24.13,111.76 24.13,105.41 26.67,102.87 29.21,102.87 33.02,99.06 33.02,87.63 34.29,86.36 36.83,86.36 38.1,85.09 38.1,55.88 40.64,53.34 40.64,43.18 41.91,41.91 E14.11
  Bottom 0.406: 15.24,115.57 E6.3 | 15.24,115.57 17.78,113.03 E6.11 | 15.24,115.57 16.51,116.84 22.86,116.84 24.13,115.57 E5.3 30.48,115.57 | 30.48,115.57 31.75,116.84 41.91,116.84 E4.3 45.72,115.57 | 45.72,115.57 46.99,116.84 57.15,116.84 E3.3 60.96,115.57 | 60.96,115.57 62.23,116.84 72.39,116.84 E2.3 76.2,115.57 78.74,113.03 E2.11 | E5.11 33.02,113.03 30.48,115.57 | E4.11 48.26,113.03 45.72,115.57 | E3.11 63.5,113.03 60.96,115.57 | E17.4 29.21,19.05 30.48,17.78 62.23,17.78 63.5,19.05 E16.4 68.58,19.05 71.12,16.51 E16.10 | E14.11 46.99,41.91 48.26,40.64 54.61,40.64 57.15,38.1 63.5,38.1 64.77,36.83 E12.6
N$6  (via drill 0.81 pad 1.27)
  Top 0.406: E14.12 44.45,44.45 46.99,46.99 46.99,50.8 48.26,52.07 | v50.8,52.07 48.26,52.07 | 48.26,52.07 46.99,53.34 46.99,82.55 48.26,83.82 54.61,83.82 55.88,82.55 E9.8 | E18.13 21.59,25.4 21.59,38.1 v20.32,39.37 19.05,39.37 17.78,40.64 17.78,43.18 19.05,44.45 v20.32,44.45
  Bottom 0.406: v20.32,44.45 22.86,44.45 24.13,45.72 29.21,45.72 30.48,46.99 30.48,52.07 31.75,53.34 36.83,53.34 39.37,50.8 49.53,50.8 v50.8,52.07
  Bottom 0.813: E18.12 E18.13
N$7
  Bottom 0.406: E9.12 60.96,95.25 60.96,99.06 66.04,104.14 69.85,104.14 E2.6
N$8  (via drill 0.81 pad 1.27)
  Top 0.813: v20.32,77.47 v20.32,80.01
  Bottom 0.406: Q3.C 13.97,82.55 19.05,77.47 v20.32,77.47 24.13,73.66 58.42,73.66 R9.1
N$9
  Top 0.406: E1.8 95.25,105.41 91.44,101.6 87.63,101.6 83.82,97.79 83.82,91.44 82.55,90.17 E7.4
N$12
  Bottom 0.406: E1.6 93.98,102.87 107.95,102.87 110.49,105.41 113.03,105.41 113.36,105.74 U$2.AJ2
N$13
  Bottom 0.406: U$2.AH2 113.36,108.89 113.03,109.22 110.49,109.22 105.41,104.14 95.25,104.14 E1.5
N$15
  Bottom 0.406: U$2.AF2 112.04,112.04 111.76,111.76 110.49,111.76 107.95,114.3 101.6,114.3 99.06,111.76 95.25,111.76 91.44,115.57 E1.3
N$16  (via drill 0.81 pad 1.27)
  other vias: 20.32,46.99
N$17
  Bottom 0.406: U$2.AE2 112.09,115.24 111.76,115.57 110.49,115.57 109.22,116.84 95.25,116.84 91.44,120.65 E1.1
N$19
  Top 0.406: E8.2 64.77,95.25 63.5,93.98 63.5,91.44 64.77,90.17 E8.4 67.31,90.17 68.58,88.9 68.58,85.09 67.31,83.82 63.5,83.82 62.23,82.55 62.23,77.47 60.96,76.2 57.15,76.2 55.88,77.47 55.88,80.01 57.15,81.28 59.69,81.28 59.69,83.82 55.88,83.82 53.34,86.36 49.53,86.36 44.45,81.28 41.91,81.28 40.64,82.55 40.64,87.63 | E10.12 41.91,92.71 40.64,91.44 40.64,87.63 | 40.64,87.63 E10.10
  Bottom 0.406: E7.11 87.63,90.17 82.55,95.25 E7.2 78.74,95.25 76.2,92.71 E8.12 71.12,92.71 68.58,95.25 E8.2 | E8.10 71.12,87.63 68.58,90.17 E8.4 | E10.1 36.83,97.79 41.91,92.71 E10.12 | E10.4 38.1,90.17 40.64,87.63 E10.10
N$20
  Top 0.406: E7.3 80.01,92.71 77.47,95.25 77.47,106.68 E2.10
N$22  (via drill 0.81 pad 1.27)
  Bottom 0.406: D2.C v20.32,49.53 25.4,49.53 D1.A
N$23  (via drill 0.81 pad 1.27)
  Bottom 0.406: D3.C v20.32,52.07 25.4,52.07 D2.A
N$24
  Top 0.406: R5.1 26.67,87.63 25.4,86.36 25.4,81.28 26.67,80.01 Q1.B
N$26
  Bottom 0.406: Q3.B 11.43,80.01 10.16,81.28 10.16,86.36 11.43,87.63 R7.1 13.97,87.63 16.51,88.9 16.51,92.71 19.05,95.25 Q2.C
N$27
  Top 0.406: R6.2 29.21,45.72 29.21,59.69 27.94,62.23 Q1.E
  Bottom 0.406: Q1.E 26.67,77.47 24.13,80.01 24.13,86.36 Q2.E
N$30
  Top 0.406: Q2.B 17.78,92.71 16.51,91.44 16.51,74.93 27.94,58.42 R8.2
  Bottom 0.406: D3.A R8.2
N$35  (via drill 0.81 pad 1.27)
  other vias: 12.7,34.29
N$40
  Top 0.406: R5.2 25.4,97.79 21.59,101.6 16.51,101.6 15.24,102.87 15.24,106.68 13.97,107.95 E6.6
N$54  (via drill 0.81 pad 1.27)
  other vias: 27.94,36.83
N$62
  Top 0.406: E13.13 60.96,46.99 62.23,45.72 62.23,33.02 63.5,31.75 66.04,31.75 73.66,30.48 74.93,30.48 80.01,25.4 82.55,25.4 E15.11
N$63  (via drill 0.81 pad 1.27)
  Top 0.406: v104.14,16.51 101.6,16.51 100.33,15.24 100.33,7.62 97.79,5.08 33.02,5.08 31.75,6.35 31.75,12.7 30.48,13.97 E17.6
  Bottom 0.406: U$2.BR2 112.09,16.84 111.76,16.51 v104.14,16.51
N$65
  Top 0.406: E8.3 67.31,93.98 67.31,100.33 60.96,104.14 60.96,111.76 59.69,113.03 E3.4
N$70  (via drill 0.81 pad 1.27)
  other vias: 27.94,92.71
N$71  (via drill 0.81 pad 1.27)
  other vias: 27.94,95.25
N$72  (via drill 0.81 pad 1.27)
  other vias: 12.7,90.17
N$73  (via drill 0.81 pad 1.27)
  other vias: 12.7,92.71
N$74  (via drill 0.81 pad 1.27)
  other vias: 12.7,95.25
N$129  (via drill 0.81 pad 1.27)
  Top 0.406: v104.14,8.89 102.87,8.89 97.79,3.81 24.13,3.81 22.86,5.08 22.86,10.16 21.59,11.43 E18.8 | v96.52,8.89 97.79,8.89 99.06,10.16 99.06,25.4 97.79,26.67 v96.52,26.67
  Bottom 0.406: v104.14,8.89 v96.52,8.89 | E15.1 83.82,26.67 85.09,27.94 92.71,27.94 93.98,26.67 v96.52,26.67
N$131
  Top 0.406: E15.3 80.01,21.59 77.47,24.13 77.47,26.67 74.93,29.21 73.66,29.21 66.04,30.48 63.5,30.48 60.96,33.02 60.96,43.18 59.69,44.45 E13.12
N$132
  Bottom 0.406: E11.3 E11.12
N$133  (via drill 0.81 pad 1.27)
  Top 0.406: 64.77,46.99 63.5,45.72 63.5,43.18 64.77,41.91 E12.4 E12.5 | 64.77,46.99 63.5,48.26 57.15,48.26 54.61,45.72 54.61,13.97 52.07,11.43 v50.8,11.43 | E18.9 21.59,13.97 22.86,15.24 31.75,15.24 E17.8 | 64.77,46.99 E12.2 E12.1
  Bottom 0.406: E17.8 v43.18,11.43 v50.8,11.43
N$138
  Top 0.406: E16.9 72.39,13.97 69.85,16.51 69.85,21.59 67.31,24.13 E16.2
N$142
  Bottom 0.406: E3.6 57.15,107.95 54.61,105.41 54.61,100.33 52.07,97.79 E9.1
N$147
  Top 0.406: E10.8 44.45,82.55 46.99,85.09 46.99,109.22 E4.4
N$152
  Bottom 0.406: E9.2 52.07,95.25 59.69,102.87 63.5,102.87 E3.8
N$153
  Bottom 0.406: E9.3 48.26,95.25 48.26,104.14 49.53,105.41 E4.8
N$154
  Bottom 0.406: E9.4 49.53,91.44 49.53,92.71 46.99,95.25 46.99,105.41 44.45,107.95 E4.6
N$155
  Bottom 0.406: E5.8 39.37,105.41 45.72,99.06 45.72,95.25 48.26,92.71 48.26,90.17 E9.5
N$156
  Bottom 0.406: E5.6 29.21,107.95 34.29,102.87 40.64,102.87 44.45,99.06 44.45,95.25 46.99,92.71 46.99,88.9 E9.6
N$161  (via drill 0.81 pad 1.27)
  Bottom 0.406: E17.2 26.67,24.13 25.4,22.86 25.4,13.97 26.67,12.7 60.96,12.7 63.5,10.16 78.74,10.16 80.01,8.89 v81.28,8.89 83.82,8.89 86.36,11.43 E15.8
N$163
  Top 0.406: E13.2 E13.1
  Bottom 0.406: E11.6 80.01,36.83 76.2,40.64 71.12,40.64 68.58,43.18 55.88,43.18 52.07,46.99 E13.2
N$166  (via drill 0.81 pad 1.27)
  Top 0.406: v43.18,16.51 44.45,16.51 45.72,17.78 45.72,22.86 44.45,24.13 v43.18,24.13
  Bottom 0.406: E17.5 29.21,16.51 30.48,15.24 40.64,15.24 41.91,16.51 v43.18,16.51 | v43.18,24.13 44.45,24.13 45.72,25.4 60.96,25.4 63.5,22.86 71.12,22.86 72.39,21.59 E16.12
N$167
  Top 0.406: E14.10 44.45,39.37 49.53,44.45 E13.3
N$171
  Top 0.406: E10.3 36.83,92.71 38.1,93.98 38.1,99.06 33.02,104.14 33.02,106.68 30.48,109.22 30.48,110.49 E5.4
N$178
  Bottom 0.406: E14.2 36.83,46.99 40.64,43.18 54.61,43.18 55.88,41.91 E13.11
N$197  (via drill 0.81 pad 1.27)
  other vias: 27.94,123.19
N$199  (via drill 0.81 pad 1.27)
  other vias: 43.18,123.19
N$203  (via drill 0.81 pad 1.27)
  other vias: 73.66,123.19
N$210  (via drill 0.81 pad 1.27)
  other vias: 66.04,80.01
N$214  (via drill 0.81 pad 1.27)
  other vias: 35.56,80.01
N$215  (via drill 0.81 pad 1.27)
  other vias: 27.94,85.09
N$217  (via drill 0.81 pad 1.27)
  other vias: 20.32,87.63
N$223  (via drill 0.81 pad 1.27)
  other vias: 5.08,97.79
N$224  (via drill 0.81 pad 1.27)
  other vias: 5.08,95.25
N$225  (via drill 0.81 pad 1.27)
  other vias: 5.08,92.71
N$226  (via drill 0.81 pad 1.27)
  other vias: 5.08,90.17
N$227  (via drill 0.81 pad 1.27)
  other vias: 5.08,87.63
N$228  (via drill 0.81 pad 1.27)
  other vias: 5.08,85.09
N$229  (via drill 0.81 pad 1.27)
  other vias: 5.08,82.55
N$230  (via drill 0.81 pad 1.27)
  other vias: 5.08,80.01
N$231  (via drill 0.81 pad 1.27)
  other vias: 5.08,123.19
N$232  (via drill 0.81 pad 1.27)
  other vias: 5.08,120.65
N$233  (via drill 0.81 pad 1.27)
  other vias: 5.08,118.11
N$234  (via drill 0.81 pad 1.27)
  other vias: 5.08,115.57
N$235  (via drill 0.81 pad 1.27)
  other vias: 5.08,113.03
N$236  (via drill 0.81 pad 1.27)
  other vias: 5.08,110.49
N$237  (via drill 0.81 pad 1.27)
  other vias: 5.08,107.95
N$238  (via drill 0.81 pad 1.27)
  other vias: 5.08,105.41
N$266  (via drill 0.81 pad 1.27)
  other vias: 5.08,11.43
N$267  (via drill 0.81 pad 1.27)
  other vias: 5.08,8.89
N$268  (via drill 0.81 pad 1.27)
  other vias: 5.08,13.97
N$269  (via drill 0.81 pad 1.27)
  other vias: 5.08,16.51
N$270  (via drill 0.81 pad 1.27)
  other vias: 5.08,19.05
N$271  (via drill 0.81 pad 1.27)
  other vias: 5.08,21.59
N$272  (via drill 0.81 pad 1.27)
  other vias: 5.08,24.13
N$273  (via drill 0.81 pad 1.27)
  other vias: 5.08,26.67
N$274  (via drill 0.81 pad 1.27)
  other vias: 5.08,36.83
N$275  (via drill 0.81 pad 1.27)
  other vias: 5.08,39.37
N$276  (via drill 0.81 pad 1.27)
  other vias: 5.08,41.91
N$277  (via drill 0.81 pad 1.27)
  other vias: 5.08,44.45
N$278  (via drill 0.81 pad 1.27)
  other vias: 5.08,46.99
N$279  (via drill 0.81 pad 1.27)
  other vias: 5.08,49.53
N$280  (via drill 0.81 pad 1.27)
  other vias: 5.08,52.07
N$281  (via drill 0.81 pad 1.27)
  other vias: 58.42,11.43
N$284  (via drill 0.81 pad 1.27)
  other vias: 66.04,8.89
N$289  (via drill 0.81 pad 1.27)
  other vias: 58.42,16.51
N$290  (via drill 0.81 pad 1.27)
  other vias: 58.42,19.05
N$291  (via drill 0.81 pad 1.27)
  other vias: 58.42,21.59
N$292  (via drill 0.81 pad 1.27)
  other vias: 50.8,21.59
N$293  (via drill 0.81 pad 1.27)
  other vias: 50.8,19.05
N$294  (via drill 0.81 pad 1.27)
  other vias: 50.8,16.51
N$296  (via drill 0.81 pad 1.27)
  other vias: 43.18,21.59
N$297  (via drill 0.81 pad 1.27)
  other vias: 43.18,19.05
N$299  (via drill 0.81 pad 1.27)
  other vias: 43.18,13.97
N$303  (via drill 0.81 pad 1.27)
  other vias: 12.7,8.89
N$304  (via drill 0.81 pad 1.27)
  other vias: 20.32,8.89
N$305  (via drill 0.81 pad 1.27)
  other vias: 27.94,8.89
N$307  (via drill 0.81 pad 1.27)
  other vias: 35.56,52.07
N$311  (via drill 0.81 pad 1.27)
  other vias: 66.04,52.07
N$314  (via drill 0.81 pad 1.27)
  other vias: 81.28,52.07
N$317  (via drill 0.81 pad 1.27)
  other vias: 96.52,49.53
N$320  (via drill 0.81 pad 1.27)
  other vias: 96.52,41.91
N$329  (via drill 0.81 pad 1.27)
  other vias: 104.14,49.53
N$330  (via drill 0.81 pad 1.27)
  other vias: 104.14,52.07
N$345  (via drill 0.81 pad 1.27)
  other vias: 96.52,19.05
N$349  (via drill 0.81 pad 1.27)
  other vias: 104.14,26.67
N$358
  Bottom 0.406: E17.12 36.83,21.59 38.1,20.32 68.58,20.32 71.12,17.78 82.55,17.78 83.82,16.51 83.82,15.24 82.55,13.97 E15.6
N$362
  Bottom 0.406: E17.9 40.64,13.97 41.91,15.24 77.47,15.24 78.74,16.51 E15.5
N$378
  Top 0.406: E3.10 69.85,106.68 69.85,85.09 72.39,82.55 E8.8
N$381
  Top 0.406: E4.10 53.34,107.95 53.34,105.41 62.23,96.52 62.23,86.36 63.5,85.09 E8.6
N$387
  Top 0.406: E10.11 44.45,90.17 45.72,91.44 45.72,99.06 38.1,106.68 38.1,107.95 E5.10
N$393
  Top 0.406: E6.10 21.59,110.49 22.86,109.22 22.86,104.14 25.4,101.6 29.21,101.6 31.75,99.06 31.75,86.36 33.02,85.09 E10.6
N$460
  Bottom 0.813: E18.10 E18.11
SELECTED
  Top 0.406: 90.17,46.99 91.44,48.26 91.44,59.69 99.06,74.93 99.06,92.71 97.79,93.98 93.98,93.98 92.71,95.25 92.71,97.79 91.44,99.06 86.36,99.06 85.09,97.79 85.09,86.36 83.82,85.09 E7.6 | 90.17,46.99 E11.13 | 90.17,46.99 91.44,45.72 91.44,43.18 90.17,41.91 E11.11
  Bottom 0.406: E7.6 E7.9
SERIAL_OUT
  Bottom 0.406: U$2.AV2 112.15,74.05 111.76,73.66 66.04,73.66 R9.2
SIZE
  Top 0.406: U$2.AK1 114.61,102.56 114.3,102.87 105.41,102.87 102.87,99.06 102.87,69.85 101.6,67.31 101.6,35.56 96.52,30.48 88.9,30.48 86.36,27.94 86.36,26.67 E15.13
SKIP
  Bottom 0.406: U$2.BJ2 112.09,35.89 111.76,35.56 109.22,35.56 106.68,33.02 92.71,33.02 91.44,34.29 E11.8
SKP_STROBE  (via drill 0.81 pad 1.27)
  Bottom 0.406: U$2.BH2 112.09,39.04 111.76,39.37 107.95,39.37 105.41,36.83 v104.14,36.83 v96.52,36.83 E11.9
STOP  (via drill 0.81 pad 1.27)
  Bottom 0.406: U$2.BN2 112.09,23.19 111.76,22.86 107.95,22.86 106.68,24.13 v104.14,24.13 v96.52,24.13 93.98,24.13 91.44,21.59 E15.12
VCC  (via drill 0.81 pad 1.27)
  Top 0.813: E1.14 97.79,120.65 99.06,121.92 99.06,124.46 97.79,125.73 C1.1 | E6.14 21.59,120.65 22.86,121.92 22.86,124.46 21.59,125.73 C6.1 | E2.14 82.55,120.65 83.82,121.92 83.82,124.46 82.55,125.73 C2.1 | E14.14 44.45,49.53 45.72,50.8 45.72,53.34 44.45,54.61 C14.1 | E7.14 90.17,97.79 91.44,96.52 91.44,78.74 90.17,77.47 C7.1 | E8.14 74.93,97.79 76.2,96.52 76.2,78.74 74.93,77.47 C8.1 | E13.14 57.15,49.53 55.88,50.8 55.88,53.34 57.15,54.61 C13.1 | v58.42,6.35 57.15,6.35 55.88,7.62 55.88,12.7 57.15,13.97 R3.2 59.69,13.97 62.23,16.51 62.23,26.67 63.82,28.26 66.04,28.26 E16.14 | E12.14 72.39,49.53 71.12,50.8 71.12,53.34 72.39,54.61 C12.1 | E15.14 91.44,26.67 92.71,25.4 92.71,7.62 91.44,6.35 C15.1 | E9.14 60.96,95.25 60.96,78.74 59.69,77.47 C9.1 | E10.14 41.91,97.79 39.37,95.25 39.37,80.01 41.91,77.47 C10.1 | E18.14 16.51,30.48 16.51,34.29 13.97,36.83 C23.1 | E5.14 34.29,120.65 33.02,121.92 33.02,124.46 34.29,125.73 C5.1 | E4.14 49.53,120.65 48.26,121.92 48.26,124.46 49.53,125.73 C4.1 | E3.14 64.77,120.65 63.5,121.92 63.5,124.46 64.77,125.73 C3.1 | E11.14 87.63,49.53 86.36,50.8 86.36,53.34 87.63,54.61 C11.1 | C17.1 36.83,6.35 38.1,7.62 38.1,25.4 36.83,26.67 E17.14
  Bottom 0.813: R8.1 11.43,54.61 10.16,53.34 10.16,40.64 11.43,39.37 R2.2 C23.1 8.89,33.02 8.89,10.16 C18.1 15.24,3.81 33.02,3.81 C17.1 v43.18,6.35 v50.8,6.35 v58.42,6.35 60.96,3.81 71.12,3.81 C16.1 76.2,3.81 86.36,3.81 C15.1 | R8.1 Q3.E 11.43,77.47 8.89,80.01 8.89,95.25 11.43,97.79 | 11.43,97.79 R7.2 v20.32,97.79 21.59,97.79 25.4,93.98 25.4,83.82 26.67,82.55 Q1.C 29.21,82.55 30.48,81.28 30.48,78.74 34.29,74.93 39.37,74.93 41.91,77.47 C10.1 45.72,74.93 55.88,74.93 C9.1 60.96,74.93 71.12,74.93 C8.1 76.2,74.93 86.36,74.93 C7.1 | U$2.AA2 108.82,127.87 106.68,125.73 C21.+ C1.1 93.98,128.27 83.82,128.27 C2.1 78.74,128.27 68.58,128.27 C3.1 63.5,128.27 53.34,128.27 C4.1 48.26,128.27 38.1,128.27 C5.1 33.02,128.27 22.86,128.27 C6.1 17.78,128.27 11.43,128.27 7.62,124.46 7.62,101.6 11.43,97.79 | U$2.BA2 112.16,58.02 111.76,58.42 107.95,58.42 C20.1 v96.52,54.61 C11.1 88.9,55.88 87.63,57.15 74.93,57.15 73.66,55.88 | 73.66,55.88 C12.1 | 58.42,55.88 C13.1 | 58.42,55.88 59.69,57.15 72.39,57.15 73.66,55.88 | 43.18,55.88 C14.1 | 43.18,55.88 44.45,57.15 57.15,57.15 58.42,55.88 | 43.18,55.88 40.64,58.42 16.51,58.42 R8.1

### Text on the board
Top: DEC | FLIP CHIP
Bottom: TELETYPE TRANSMITTER M707C
200bmp: C:/Users/Vince/Documents/websvn/trunk/Eagle/projects/DEC/Mxxx/M707/M707Cfoo.bmp